# EasyEDA Pro project guitar-wireless-system.eprj

# Schematic Schematic1
Create Date: 2024-03-23; Page Name: P1; Project Name: guitar-wireless-system; Schematic Name: Schematic1; Update Date: 2025-01-12; Company: 嘉立创EDA; Page Size: A4; Version: V1.0
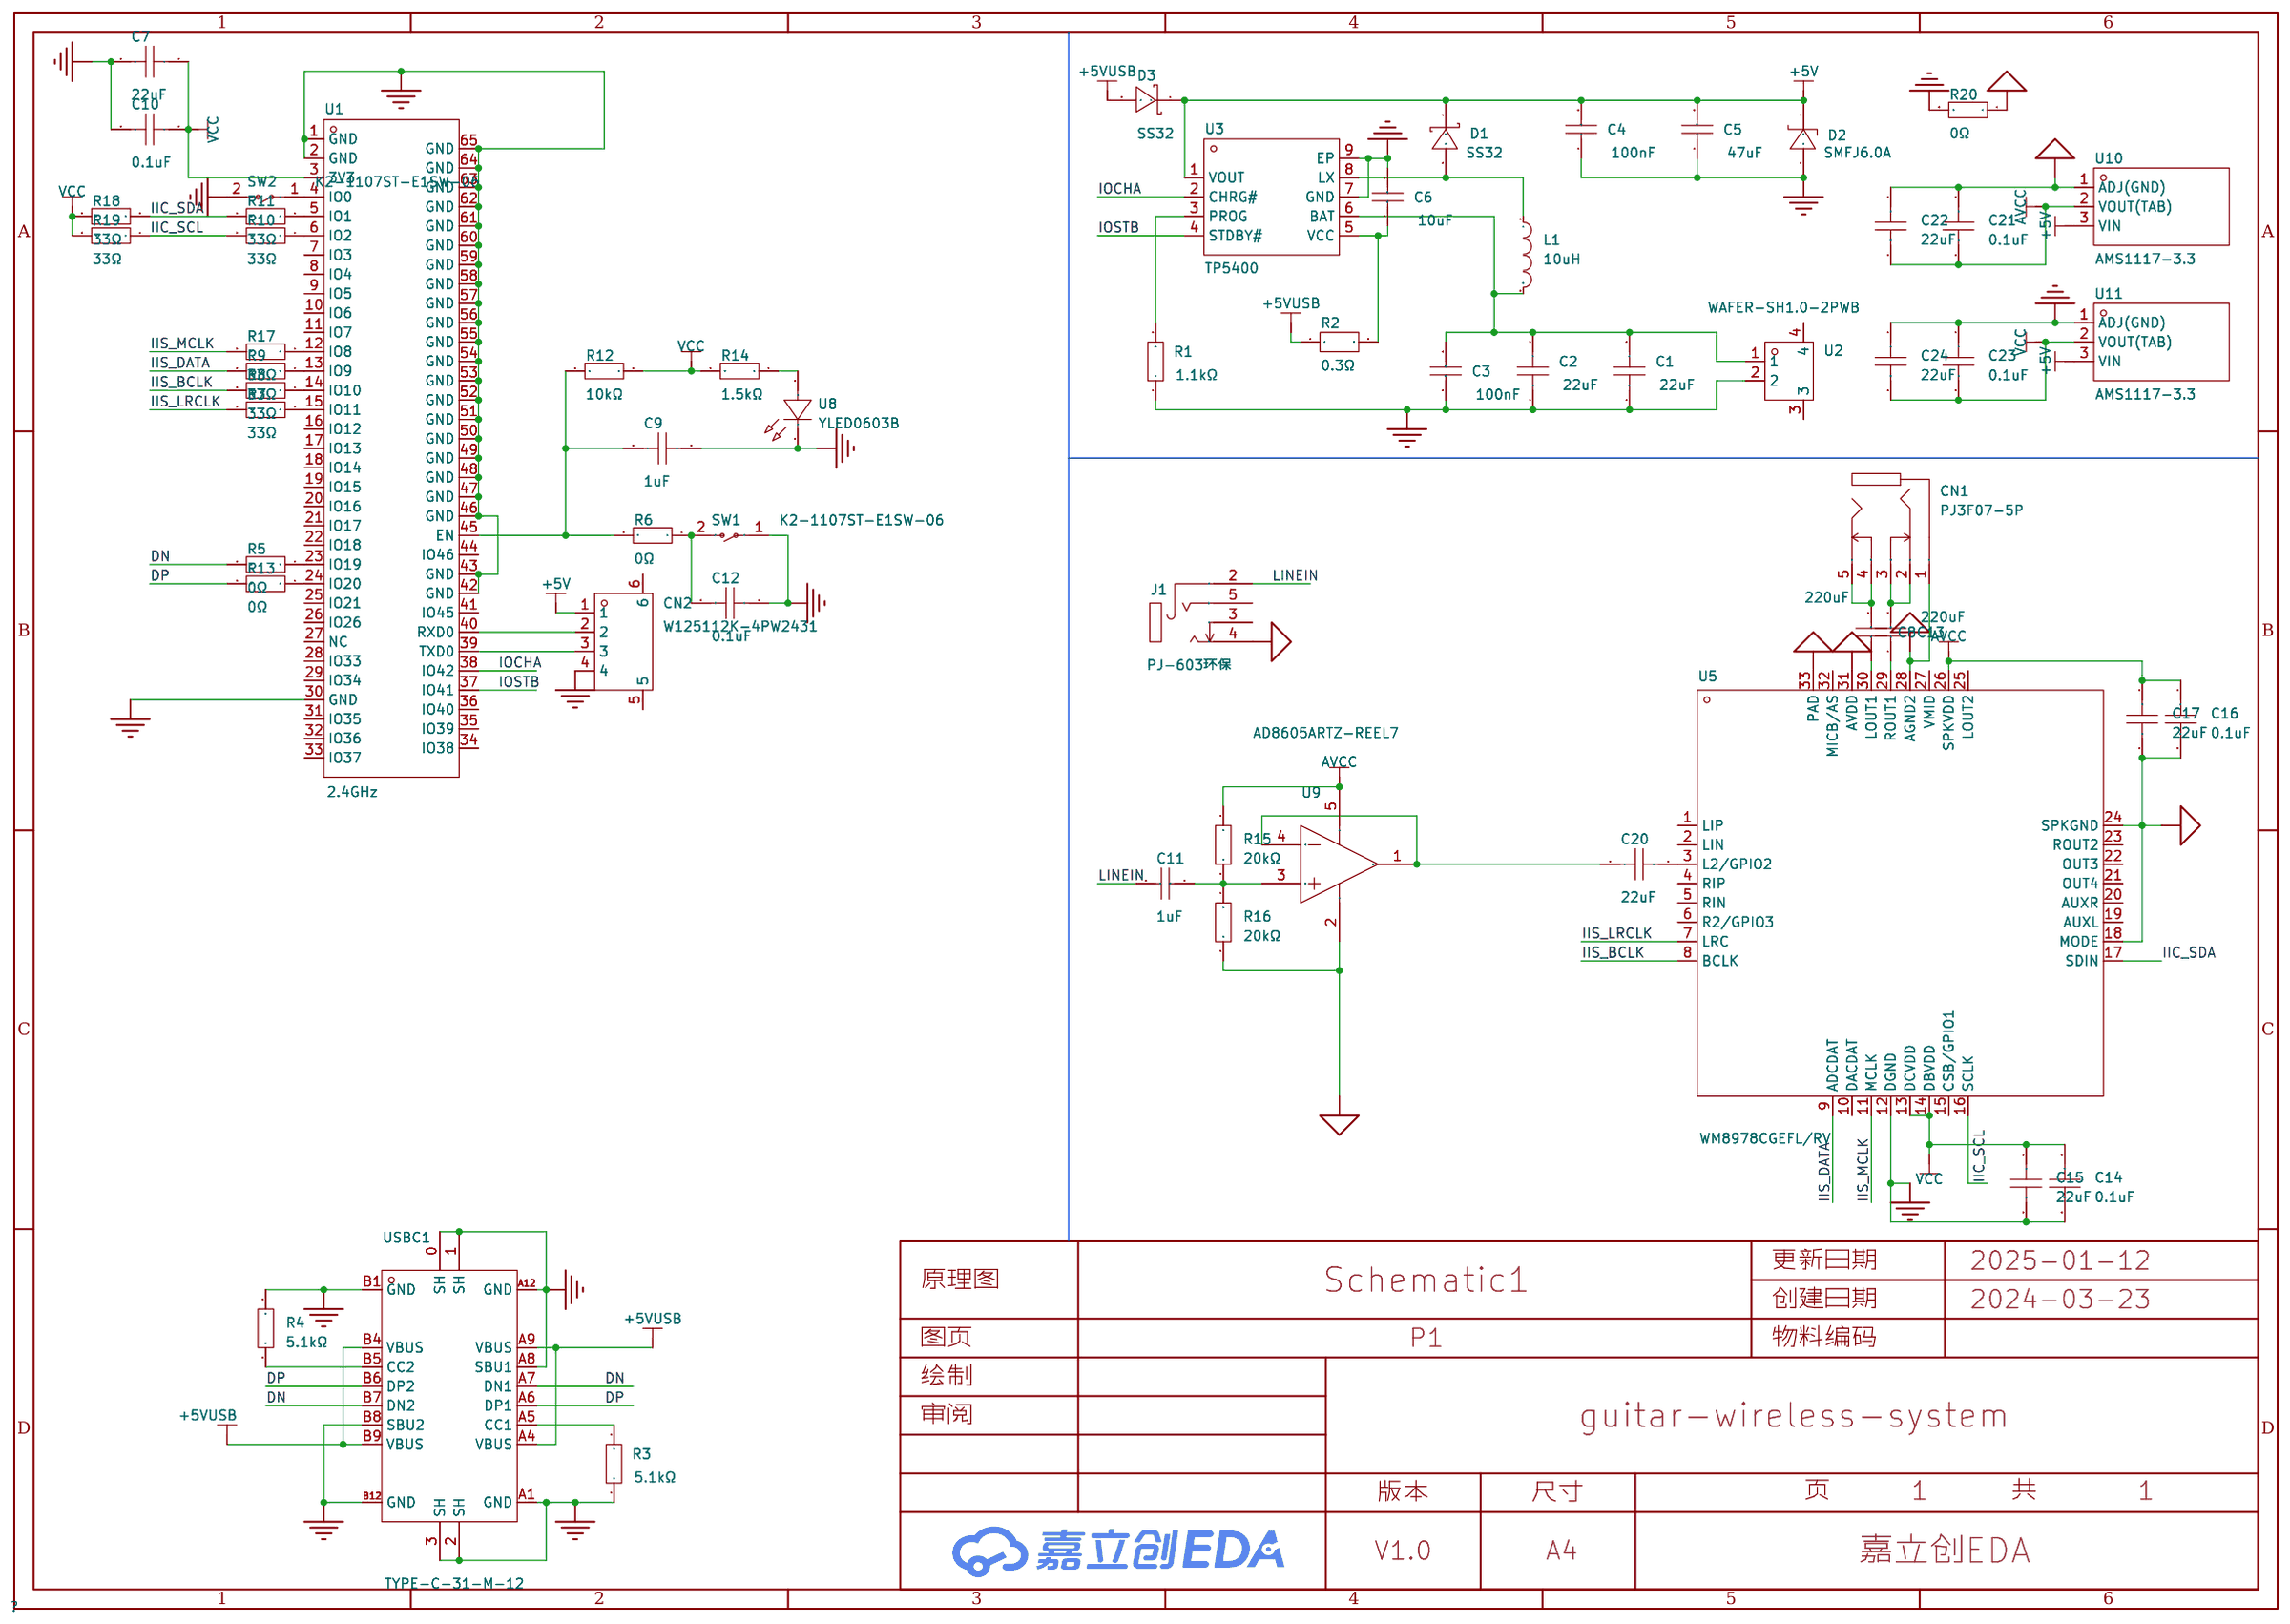
[diagram p0: schematic sheet]

## Parts
C1  22uF  [C0603]
C2  22uF  [C0603]
C3  100nF  [C0603]
C4  100nF  [C0603]
C5  47uF  [C0805]
C6  10uF  [C0805]
C7  22uF  [C0603]
C8  220uF  [C0805]
C9  1uF  [C0603]
C10  0.1uF  [C0603]
C11  1uF  [C0805]
C12  0.1uF  [C0603]
C13  220uF  [C0805]
C14  0.1uF  [C0603]
C15  22uF  [C0603]
C16  0.1uF  [C0603]
C17  22uF  [C0603]
C20  22uF  [C0603]
C21  0.1uF  [C0603]
C22  22uF  [C0603]
C23  0.1uF  [C0603]
C24  22uF  [C0603]
CN1  PJ3F07-5P  [AUDIO-TH_PJ3F07-5P]
CN2  W125112K-4PW2431  [CONN-SMD_4P-P1.25_W125112K-4PW2431]
D1  SS32  [SMA_L4.3-W2.6-LS5.2-RD]
D2  SMFJ6.0A  [SOD-123_L2.8-W1.8-LS3.7-RD]
D3  SS32  [SMA_L4.3-W2.6-LS5.2-RD]
J1  PJ-603环保  [AUDIO-TH_PJ-603]
L1  10uH  [IND-SMD_L7.3-W6.8]
R1  1.1kΩ  [R0603]
R2  0.3Ω  [R1812]
R3  5.1kΩ  [R0603]
R4  5.1kΩ  [R0603]
R5  0Ω  [R0603]
R6  0Ω  [R0603]
R7  33Ω  [R0603]
R8  33Ω  [R0603]
R9  33Ω  [R0603]
R10  33Ω  [R0603]
R11  33Ω  [R0603]
R12  10kΩ  [R0603]
R13  0Ω  [R0603]
R14  1.5kΩ  [R0603]
R15  20kΩ  [R0603]
R16  20kΩ  [R0603]
R17  33Ω  [R0603]
R18  33Ω  [R0603]
R19  33Ω  [R0603]
R20  0Ω  [R0603]
SW1  K2-1107ST-E1SW-06  [SW-SMD_L6.0-W3.6-LS8.0]
SW2  K2-1107ST-E1SW-06  [SW-SMD_L6.0-W3.6-LS8.0]
U1  2.4GHz  [WIFI-SMD_ESP32-MINI-1-N4]
U2  WAFER-SH1.0-2PWB  [CONN-SMD_2P-P1.00_XUNPU_WAFER-SH1.0-2PWB]
U3  TP5400  [ESOP-8_L4.9-W3.9-P1.27-LS6.0-BL-EP]
U5  WM8978CGEFL/RV  [WQFN-32_L5.0-W5.0-P0.50-TL-EP]
U8  YLED0603B  [LED0603-RD]
U9  AD8605ARTZ-REEL7  [SOT-23-5_L3.0-W1.7-P0.95-LS2.8-BR]
U10  AMS1117-3.3  [SOT-89_L4.5-W2.5-P1.50-LS4.2-BR]
U11  AMS1117-3.3  [SOT-89_L4.5-W2.5-P1.50-LS4.2-BR]
USBC1  TYPE-C-31-M-12  [USB-C_SMD-TYPE-C-31-M-12]

## Library data of the parts
C1 C2 C7 C9 C10 C12 C14-C17 C20-C24 = CL10A226MQ8NRNC: 容值:22uF;精度:±20%;额定电压:6.3V;材质(温度系数):X5R;; LCSC Part Name: 22uF ±20% 6.3V; Supplier Part: C59461; Manufacturer: SAMSUNG(三星); Supplier Footprint: 0603; JLCPCB Part Class: 基础库; Datasheet: https://atta.szlcsc.com/upload/public/pdf/source/20160218/1457707763339.pdf; Supplier: LCSC; Tolerance: ±20%; Voltage Rated: 6.3V; Temperature Coefficient: X5R
C3 C4 = 0603B104K500NT: 容值:100nF;精度:±10%;额定电压:50V;材质(温度系数):X7R;; LCSC Part Name: 100nF ±10% 50V; Supplier Part: C30926; Manufacturer: FH(风华); Supplier Footprint: 0603; JLCPCB Part Class: 扩展库; Datasheet: https://atta.szlcsc.com/upload/public/pdf/source/20200305/C486355_26A10D38EF8C2A5C37091D0039909270.pdf; Supplier: LCSC; Tolerance: ±10%; Voltage Rated: 50V; Temperature Coefficient: X7R
C5 C6 C8 C11 C13 = CL21A476MQYNNNE: 容值:47uF;精度:±20%;额定电压:6.3V;材质(温度系数):X5R;; LCSC Part Name: 47uF ±20% 6.3V; Supplier Part: C16780; Manufacturer: SAMSUNG(三星); Supplier Footprint: 0805; JLCPCB Part Class: 基础库; Datasheet: https://atta.szlcsc.com/upload/public/pdf/source/20160218/1457707763339.pdf; Supplier: LCSC; Tolerance: ±20%; Voltage Rated: 6.3V; Temperature Coefficient: X5R
CN1 = PJ3F07-5P: 连接器类型:3.5mm耳机座;额定电流:500mA;额定电压:30V;工作温度范围:-30℃~+70℃;; LCSC Part Name: 3.5mm耳机座; Supplier Part: C668604; Manufacturer: SHOU HAN(首韩); Supplier Footprint: 插件; JLCPCB Part Class: 扩展库; Datasheet: https://atta.szlcsc.com/upload/public/pdf/source/20200618/C668604_553D34851BA3C54B8828FD92D0D96818.pdf; Supplier: LCSC; Connector Type: 3.5mm耳机座; Current Rating (Max): 500mA; Voltage Rating (Max): 30V; Operating Temperature Range: -30℃~+70℃
CN2 = W125112K-4PW2431: 排数：单排 总PIN位数：4P 间距：1.25mm 针脚结构：1x4P 安装类型：卧贴  是否带锁扣：带扣 触头材质：黄铜 工作温度范围：-25℃~+85℃ 颜色：白色; LCSC Part Name: GH1.25 1x4P 卧贴; Supplier Part: C42382908; Manufacturer: HMTCONN(华明通); Supplier Footprint: SMD,P=1.25mm,卧贴; Datasheet: https://atta.szlcsc.com/upload/public/pdf/source/20241113/DA676F2A3096D0EC53C09A6060F09192.pdf; Supplier: LCSC
D1 D3 = SS32_C34897: 二极管配置:-;正向压降(Vf):550mV@3A;直流反向耐压(Vr):20V;平均整流电流(Io):3A;; LCSC Part Name: 电压:20V 电流:3A; Supplier Part: C34897; Manufacturer: MDD; Supplier Footprint: SMA(DO-214AC); JLCPCB Part Class: 扩展库; Datasheet: https://atta.szlcsc.com/upload/public/pdf/source/20230314/A80AE34493C69B89E2F4B1712F433538.pdf; Supplier: LCSC; Forward Voltage (Vf@If): 550mV@3A; Reverse Voltage (Vr): 20V; Average Rectified Current (Io): 3A
D2 = SMFJ6.0A_C44898: 反向截止电压(Vrwm):6V;最大钳位电压:10.3V;峰值脉冲电流(Ipp)@10/1000us:19.4A;击穿电压:6.67V;; Supplier Part: C44898; Manufacturer: RUILON(瑞隆源); Supplier Footprint: SOD-123; JLCPCB Part Class: 扩展库; Datasheet: https://atta.szlcsc.com/upload/public/pdf/source/20170601/1496285789057.pdf; Supplier: LCSC; Reverse Stand-Off Voltage (Vrwm): 6V; Maximum Clamping Voltage: 10.3V; Peak Pulse Current (Ipp)@10/1000us: 19.4A; Breakdown Voltage: 6.67V; Type: TVS
J1 = PJ-603环保: 连接器类型:6.35mm耳机座;额定电流:500mA;额定电压:30V;工作温度范围:-20℃~+70℃;; LCSC Part Name: 6.35mm耳机座 三件套; Supplier Part: C309272; Manufacturer: HOOYA(皓宇电子); Supplier Footprint: 插件; JLCPCB Part Class: Extended Part; Datasheet: https://atta.szlcsc.com/upload/public/pdf/source/20181226/C309272_C0E7296048E854FEB179FBAD0ADF7BD0.pdf; Supplier: LCSC; Connector Type: 6.35mm耳机座; Current Rating (Max): 500mA; Voltage Rating (Max): 30V; Operating Temperature Range: -20℃~+70℃
L1 = FXL0630-100-M: 电感值:10uH;精度:±20%;额定电流:4.5A;饱和电流(Isat):5.5A;类型:一体成型电感;; LCSC Part Name: 10uH ±20% 5.5A; Supplier Part: C167223; Manufacturer: cjiang(长江微电); Supplier Footprint: SMD,6.6x7mm; JLCPCB Part Class: 扩展库; Datasheet: https://atta.szlcsc.com/upload/public/pdf/source/20230516/3A080F5AF8C87BB81C3BA86E5F60E51A.pdf; Supplier: LCSC; Tolerance: ±20%; Rated Current: 4.5A; Saturation Current (Isat): 5.5A; DC Resistance (DCR): 68mΩ; Type: 一体成型电感
R1 R3-R20 = RC0603FR-071KL: 电阻类型:厚膜电阻;阻值:1kΩ;精度:±1%;功率:100mW;最大工作电压:75V;温度系数:±100ppm/℃;; LCSC Part Name: 厚膜电阻 1kΩ ±1% 100mW; Supplier Part: C22548; Manufacturer: YAGEO(国巨); Supplier Footprint: 0603; JLCPCB Part Class: 扩展库; Datasheet: https://atta.szlcsc.com/upload/public/pdf/source/20180316/70C0E2BDAE7FCC62C531A5A58D202EE1.pdf; Supplier: LCSC; Type: 厚膜电阻; Tolerance: ±1%; Power(Watts): 100mW; Overload Voltage (Max): 75V; Temperature Coefficient: ±100ppm/℃; Operating Temperature Range: -55℃~+155℃
R2 = FRC1812F1004TS: 电阻类型:厚膜电阻;阻值:1MΩ;精度:±1%;功率:750mW;最大工作电压:200V;温度系数:±100ppm/℃;; LCSC Part Name: 1MΩ ±1% 750mW 厚膜电阻; Supplier Part: C2933874; Manufacturer: FOJAN(富捷); Supplier Footprint: 1812; JLCPCB Part Class: 扩展库; Datasheet: https://atta.szlcsc.com/upload/public/pdf/source/20211221/925EC7D7225764EE0046F22065062C87.pdf; Supplier: LCSC; Type: 厚膜电阻; Tolerance: ±1%; Power(Watts): 750mW; Overload Voltage (Max): 200V; Temperature Coefficient: ±100ppm/℃; Operating Temperature Range: -55℃~+155℃
SW1 SW2 = K2-1107ST-E1SW-06: 作用力:90gf;安装方式:立贴;开关长度:6.1mm;开关宽度:3.6mm;开关高度:2.5mm;触点电流:50mA;额定电压(DC):12V;绝缘电阻:100MΩ;机械寿命:10万次;; LCSC Part Name: 362.5 进口弹片 有防水膜 灰胶头100G; Supplier Part: C707329; Manufacturer: 韩国韩荣; Supplier Footprint: SMD; JLCPCB Part Class: 扩展库; Datasheet: https://atta.szlcsc.com/upload/public/pdf/source/20210810/381712CEF248770C072B585C3485C888.pdf; Supplier: LCSC; Operating Force: 90gf; Mounting Style: 立贴; Switch Length: 6.1mm; Switch Width: 3.6mm; Switch Height: 2.5mm; Contact Current: 50mA; Voltage Rating (DC): 12V; Insulation Resistance: 100MΩ; Mechanical Life: 10万次; Operating Temperature: -25℃~+85℃
U1 = ESP32-S2-MINI-1-N4: 核心处理器:ESP32-S2FH4芯片;频率:2.4GHz;发射功率:19.5dBm;; Supplier Part: C2847294; Manufacturer: ESPRESSIF(乐鑫); Supplier Footprint: SMD-65P; JLCPCB Part Class: 扩展库; Datasheet: https://atta.szlcsc.com/upload/public/pdf/source/20210720/C2847294_01EA0498BFFB937767F2095C488AE4D4.pdf; Supplier: LCSC; Core Processor: ESP32-S2FH4芯片; Support Interface: I2C；GPIO；SPI；PWM；ADC；UART；USB；I2S; Output Power: 19.5dBm
U2 = WAFER-SH1.0-2PWB: 插针结构:1x2P;间距:1mm;安装方式:卧贴;总PIN数:2P;排数:1;每排PIN数:2;额定电流:1A;工作温度范围:-25℃~+85℃;; LCSC Part Name: 1x2P 间距:1mm 卧贴; Supplier Part: C3029341; Manufacturer: XUNPU(讯普); Supplier Footprint: SMD,P=1mm,卧贴; JLCPCB Part Class: 扩展库; Datasheet: https://atta.szlcsc.com/upload/public/pdf/source/20220527/1879B8210BD3B2006BCEAC1A40D397B6.pdf; Supplier: LCSC; Pins Structure: 1x2P; Pitch: 1mm; Mounting Style: 卧贴; Number of Pins: 2P; Number of Rows: 1; Number of PINs Per Row: 2; Current Rating (Max): 1A; Operating Temperature Range: -25℃~+85℃
U3 = TP5400: Supplier Part: C2891434; Manufacturer: TOPPOWER(南京拓微); Supplier Footprint: ESOP-8; JLCPCB Part Class: 扩展库; Datasheet: https://atta.szlcsc.com/upload/public/pdf/source/20210909/352D9D40D77A1DD73F7904E364EF004B.pdf; Supplier: LCSC
U5 = WM8978CGEFL/RV: LCSC Part Name: WM8978CGEFL/RV 停产; Supplier Part: C323850; Manufacturer: Cirrus Logic(凌云); Supplier Footprint: WQFN-32-EP(5x5); JLCPCB Part Class: 扩展库; Datasheet: https://atta.szlcsc.com/upload/public/pdf/source/20181105/C323850_5F65153DE4172B7DF9579D926852F69A.pdf; Supplier: LCSC
U8 = YLED0603B: 发光颜色:蓝色;正向电压(VF):2.6V~3.2V;功率:-;正向电流:30mA;主波长:460nm~475nm;发光角度:120°;工作温度:-40℃~+85℃;; Supplier Part: C19171394; Manufacturer: YONGYUTAI(永裕泰); Supplier Footprint: 0603; JLCPCB Part Class: 扩展库; Datasheet: https://atta.szlcsc.com/upload/public/pdf/source/20231027/6134FF4BA718E32A802654BBC76F69A6.pdf; Supplier: LCSC; Emitted Color: 蓝色; Forward Voltage (VF): 2.6V~3.2V; Forward Current: 30mA; Dominant Wavelength: 460nm~475nm; Viewing Angle: 120°; Operating Temperature: -40℃~+85℃
U9 = AD8605ARTZ-REEL7: 放大器数:单路;增益带宽积(GBP):10MHz;输入偏置电流(Ib):0.2pA;压摆率(SR):5V/us;轨到轨:-;; LCSC Part Name: 精密、低噪声、轨到轨输入输出、CMOS运算放大器（双路）; Supplier Part: C9641; Manufacturer: ADI(亚德诺); Supplier Footprint: SOT-23-5; JLCPCB Part Class: 扩展库; Datasheet: https://atta.szlcsc.com/upload/public/pdf/source/20121029/1457706543879.pdf; Supplier: LCSC; Number of Circuits: 单路; Gain Bandwidth Product(GBP): 10MHz; Current - Input Bias(Ib): 0.2pA; Slew Rate(SR): 5V/us; Output Current: 80mA; Operating Temperature: -40℃~+125℃
U10 U11 = AMS1117-3.3_C347256: 输出类型:固定;工作电压:18V;输出电压:3.3V;输出电流:1A;电源纹波抑制比(PSRR):60dB@(120Hz);输出极性:正极;; LCSC Part Name: 输出:3.3V 电流:1A 耐压:12V; Supplier Part: C347256; Manufacturer: UMW(友台半导体); Supplier Footprint: SOT-89; Datasheet: https://atta.szlcsc.com/upload/public/pdf/source/20241218/BAF0263FA2E44BCD8AF41AA4FA04EFAA.pdf; Supplier: LCSC; Output Type: 固定; Maximum Input Voltage: 18V; Output Voltage: 3.3V; Output Current: 1A; Power Supply Rejection Ratio (PSRR): 60dB@(120Hz); Dropout Voltage: 1.3V@(1A); Feature: 过流保护(OCP); Output Polarity: 正极; Number of Outputs: 1
USBC1 = TYPE-C-31-M-12: 连接器类型:Type-C;标准:-;公母:母;端口数量:1;触点数量:16P;安装方式:-;额定电流 - 电源:5A;触头材质:-;触头镀层:-;工作温度范围:-;焊接温度(最大值):-;; LCSC Part Name: Type-C 母; Supplier Part: C165948; Manufacturer: 韩国韩荣; Supplier Footprint: SMD; JLCPCB Part Class: 扩展库; Datasheet: https://atta.szlcsc.com/upload/public/pdf/source/20220525/466408E853115E789EDB0DDC29077C05.pdf; Supplier: LCSC; Connector Type: Type-C; Gender: 母; Number of Ports: 1; Number of Contacts: 16P; Current Rating - Power (Max): 5A

## Nets
+5V: C4.2 C5.2 CN2.1 D1.1(K) D2.1(K) D3.1(K) U3.1(VOUT) U10.3(VIN) U11.3(VIN)
+5VUSB: D3.2(A) R2.1 USBC1.A4(VBUS) USBC1.A9(VBUS) USBC1.B4(VBUS) USBC1.B9(VBUS)
AGND: C16.2 C17.2 C21.1 C22.1 CN1.1(A) J1.4 R16.2 R20.1 U5.18(MODE) U5.24(SPKGND) U5.28(AGND2) U5.31(AVDD) U5.33(PAD) U9.2(-V) U10.1(ADJ(GND))
AVCC: C16.1 C17.1 C21.2 C22.2 R15.1 U5.26(SPKVDD) U9.5(+V) U10.2(VOUT(TAB))
GND: C1.1 C2.1 C3.1 C4.1 C5.1 C6.2 C7.2 C9.1 C10.2 C12.1 C14.2 C15.2 C23.1 C24.1 CN2.4 D2.2(A) R1.1 R3.1 R4.1 R20.2 SW1.1 SW2.2 U1.1(GND) U1.2(GND) U1.30(GND) U1.42(GND) U1.43(GND) U1.46(GND) U1.47(GND) U1.48(GND) U1.49(GND) U1.50(GND) U1.51(GND) U1.52(GND) U1.53(GND) U1.54(GND) U1.55(GND) U1.56(GND) U1.57(GND) U1.58(GND) U1.59(GND) U1.60(GND) U1.61(GND) U1.62(GND) U1.63(GND) U1.64(GND) U1.65(GND) U2.2 U3.7(GND) U3.9(EP) U5.12(DGND) U8.1(K) U11.1(ADJ(GND)) USBC1.0(SH) USBC1.1(SH) USBC1.2(SH) USBC1.3(SH) USBC1.A1(GND) USBC1.A8(SBU1) USBC1.A12(GND) USBC1.B1(GND) USBC1.B8(SBU2) USBC1.B12(GND)
VCC: C7.1 C10.1 C14.1 C15.1 C23.2 C24.2 R12.1 R14.2 R18.2 R19.2 U1.3(3V3) U5.13(DCVDD) U5.14(DBVDD) U11.2(VOUT(TAB))
DN: R5.2 USBC1.A7(DN1) USBC1.B7(DN2)
DP: R13.2 USBC1.A6(DP1) USBC1.B6(DP2)
IIC_SCL: R10.2 R19.1 U5.16(SCLK)
IIC_SDA: R11.2 R18.1 U5.17(SDIN)
IIS_BCLK: R8.2 U5.8(BCLK)
IIS_DATA: R9.2 U5.9(ADCDAT)
IIS_LRCLK: R7.2 U5.7(LRC)
IIS_MCLK: R17.2 U5.11(MCLK)
IOCHA: U1.38(IO42) U3.2(CHRG#)
IOSTB: U1.37(IO41) U3.4(STDBY#)
LINEIN: C11.2 J1.2
$1N1673: R1.2 U3.3(PROG)
$1N3550: C6.1 R2.2 U3.5(VCC)
$1N3997: D1.2(A) L1.1 U3.8(LX)
$1N3998: C1.2 C2.2 C3.2 L1.2 U2.1 U3.6(BAT)
$1N4862: R3.2 USBC1.A5(CC1)
$1N6147: R4.2 USBC1.B5(CC2)
$1N12969: C12.2 R6.1 SW1.2
$1N13877: C9.2 R6.2 R12.2 U1.45(EN)
$1N19075: C8.2 CN1.4(D) CN1.5(E)
$1N19138: C13.2 CN1.2(B) CN1.3(C)
$1N22244: C8.1 U5.30(LOUT1)
$1N22432: C13.1 U5.29(ROUT1)
$1N23425: R13.1 U1.24(IO20)
$1N23503: R5.1 U1.23(IO19)
$1N35924: R14.1 U8.2(A)
$1N36589: CN2.2 U1.40(RXD0)
$1N36667: CN2.3 U1.39(TXD0)
$1N39673: C20.2 U5.3(L2/GPIO2)
$1N42115: C20.1 U9.1(OUT) U9.4(-IN)
$1N45611: C11.1 R15.2 R16.1 U9.3(+IN)
$1N56057: R10.1 U1.6(IO2)
$1N56058: R11.1 U1.5(IO1)
$1N56623: R17.1 U1.12(IO8)
$1N56625: R7.1 U1.15(IO11)
$1N56627: R8.1 U1.14(IO10)
$1N56629: R9.1 U1.13(IO9)
$1N61302: SW2.1 U1.4(IO0)

Not connected (* = marked no-connect by the designer): CN2 5 6; J1 3 5; U1 7(IO3) 8(IO4) 9(IO5) 10(IO6) 11(IO7) 16(IO12) 17(IO13) 18(IO14) 19(IO15) 20(IO16) 21(IO17) 22(IO18) 25(IO21) 26(IO26) 27(NC) 28(IO33) 29(IO34) 31(IO35) 32(IO36) 33(IO37) 34(IO38) 35(IO39) 36(IO40) 41(IO45) 44(IO46); U2 3 4; U5 1(LIP) 2(LIN) 4(RIP) 5(RIN) 6(R2/GPIO3) 10(DACDAT) 15(CSB/GPIO1) 19(AUXL) 20(AUXR) 21(OUT4) 22(OUT3) 23(ROUT2) 25(LOUT2) 27(VMID) 32(MICB/AS)

# Board PCB1
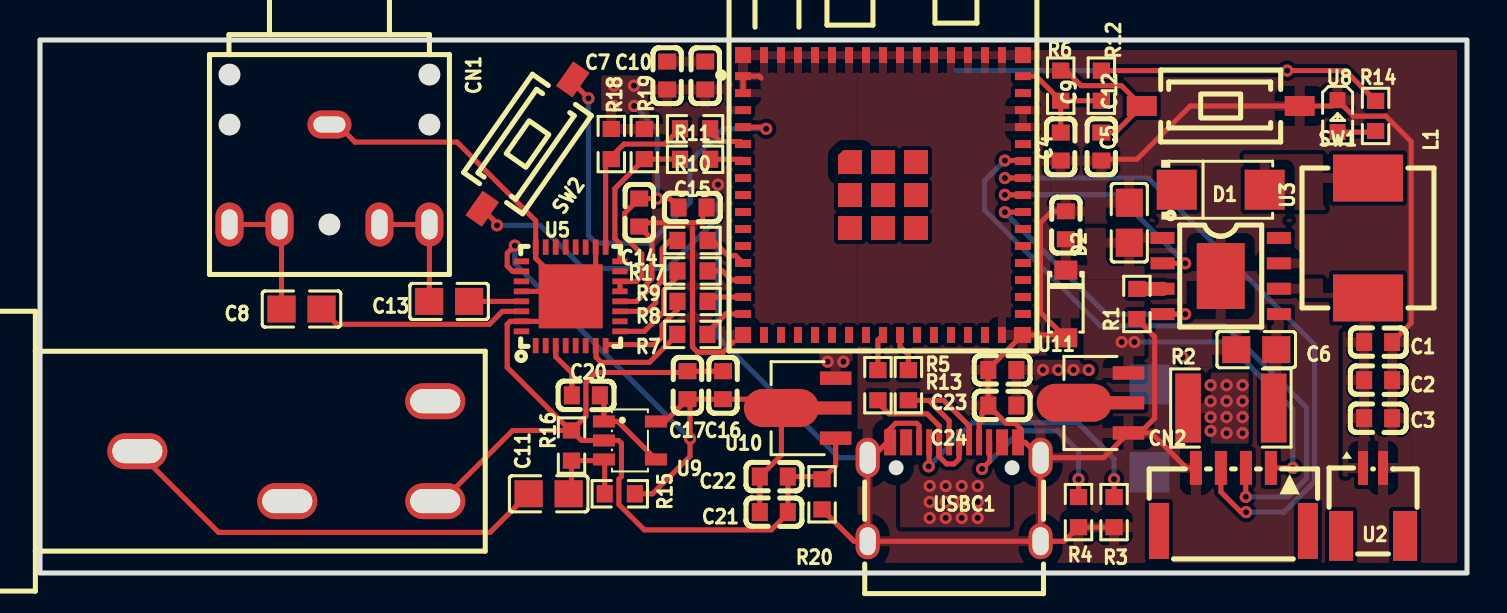
[diagram p1: board, top side]
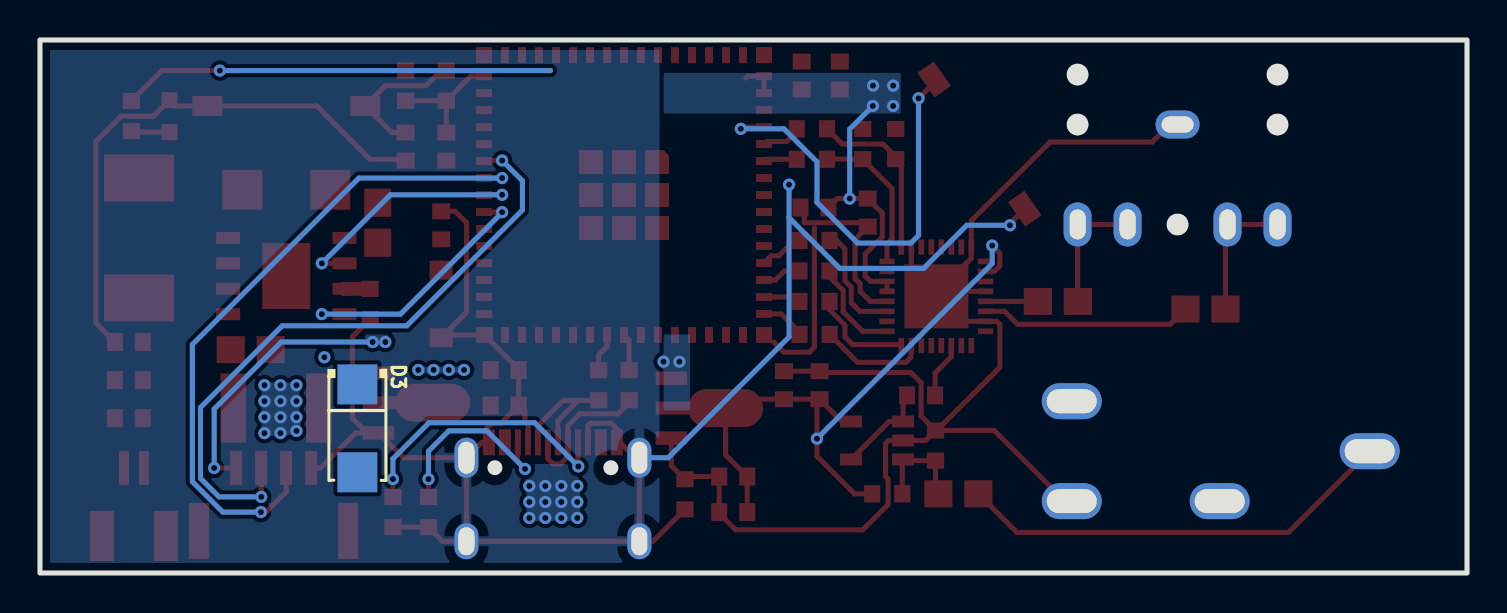
[diagram p2: board, bottom side, seen from below]

Outline 71.37 x 26.67 mm; copper layers: Top Layer, Bottom Layer. Coordinates in mm from the lower left corner of the outline.
Outline path: rectangle 0,26.67 71.37,0
Stack: Top Layer 0.035mm / Dielectric1 1.51mm FR4 er 4.5 / Bottom Layer 0.035mm

## Design rules (mm)
spacing safeClearance (default): track to track 0.152, other pairs 0.152 to 0.3
track width trackWidth (default): min 0.127, default 0.254, max 2.54
differential pair differentialPair (default): width min 0.127, default 0.254, max 2.54; gap min 0.152, default 0.152
via viaSize (default): diameter min 0.5, default 0.61, max 10; hole min 0.3, default 0.305, max 6
pour e115 uses copperRegion1

## Placement (name value [footprint] x y rotation side)
C1  22uF  [C0603]  66.93 11.56 180 top
C2  22uF  [C0603]  66.93 9.65 180 top
C3  100nF  [C0603]  66.93 7.75 180 top
C4  100nF  [C0603]  51.31 17.4 270 top
C5  47uF  [C0805]  54.48 17.53 270 top
C6  10uF  [C0805]  60.83 11.18 180 top
C7  22uF  [C0603]  31.37 24.89 90 top
C8  220uF  [C0805]  13.08 13.21 180 top
C9  1uF  [C0603]  51.05 21.34 90 top
C10  0.1uF  [C0603]  33.27 24.89 90 top
C11  1uF  [C0805]  25.44 3.97 180 top
C12  0.1uF  [C0603]  53.09 21.34 90 top
C13  220uF  [C0805]  20.46 13.59 180 top
C14  0.1uF  [C0603]  29.97 18.03 270 top
C15  22uF  [C0603]  32.64 18.29 0 top
C16  0.1uF  [C0603]  34.16 9.4 90 top
C17  22uF  [C0603]  32.38 9.4 90 top
C20  22uF  [C0603]  27.31 8.89 180 top
C21  0.1uF  [C0603]  36.7 3.05 180 top
C22  22uF  [C0603]  36.7 4.83 180 top
C23  0.1uF  [C0603]  48.13 10.16 0 top
C24  22uF  [C0603]  48.13 8.38 0 top
CN1  PJ3F07-5P  [AUDIO-TH_PJ3F07-5P]  14.48 19.94 0 top
CN2  W125112K-4PW2431  [CONN-SMD_4P-P1.25_W125112K-4PW2431]  59.69 3.68 0 top
D1  SS32  [SMA_L4.3-W2.6-LS5.2-RD]  59.06 19.18 0 top
D2  SMFJ6.0A  [SOD-123_L2.8-W1.8-LS3.7-RD]  51.31 13.46 270 top
D3  SS32  [SMA_L4.3-W2.6-LS5.2-RD]  55.5 7.24 270 bottom
J1  PJ-603环保  [AUDIO-TH_PJ-603]  12.32 6.1 0 top
L1  10uH  [IND-SMD_L7.3-W6.8]  66.42 16.76 270 top
R1  1.1kΩ  [R0603]  54.86 13.46 90 top
R2  0.3Ω  [R1812]  59.56 8.25 0 top
R3  5.1kΩ  [R0603]  53.72 3.05 90 top
R4  5.1kΩ  [R0603]  51.94 3.05 90 top
R5  0Ω  [R0603]  41.91 9.4 270 top
R6  0Ω  [R0603]  51.05 24.38 270 top
R7  33Ω  [R0603]  32.63 11.94 180 top
R8  33Ω  [R0603]  32.64 13.59 180 top
R9  33Ω  [R0603]  32.64 15.11 180 top
R10  33Ω  [R0603]  32.77 20.7 180 top
R11  33Ω  [R0603]  32.77 22.22 180 top
R12  10kΩ  [R0603]  53.09 24.38 270 top
R13  0Ω  [R0603]  43.43 9.4 270 top
R14  1.5kΩ  [R0603]  66.8 22.87 90 top
R15  20kΩ  [R0603]  29 3.97 180 top
R16  20kΩ  [R0603]  26.59 6.38 90 top
R17  33Ω  [R0603]  32.64 16.64 180 top
R18  33Ω  [R0603]  28.57 21.46 90 top
R19  33Ω  [R0603]  30.23 21.46 90 top
R20  0Ω  [R0603]  39.12 3.94 270 top
SW1  K2-1107ST-E1SW-06  [SW-SMD_L6.0-W3.6-LS8.0]  59.06 23.37 180 top
SW2  K2-1107ST-E1SW-06  [SW-SMD_L6.0-W3.6-LS8.0]  24.38 21.46 235 top
U1  2.4GHz  [WIFI-SMD_ESP32-MINI-1-N4]  42.16 18.91 0 top
U2  WAFER-SH1.0-2PWB  [CONN-SMD_2P-P1.00_XUNPU_WAFER-SH1.0-2PWB]  66.67 3.56 0 top
U3  TP5400  [ESOP-8_L4.9-W3.9-P1.27-LS6.0-BL-EP]  59.06 14.86 270 top
U5  WM8978CGEFL/RV  [WQFN-32_L5.0-W5.0-P0.50-TL-EP]  26.54 13.84 90 top
U8  YLED0603B  [LED0603-RD]  64.9 22.86 270 top
U9  AD8605ARTZ-REEL7  [SOT-23-5_L3.0-W1.7-P0.95-LS2.8-BR]  29.51 6.63 180 top
U10  AMS1117-3.3  [SOT-89_L4.5-W2.5-P1.50-LS4.2-BR]  38.44 8.25 0 top
U11  AMS1117-3.3  [SOT-89_L4.5-W2.5-P1.50-LS4.2-BR]  53.09 8.51 0 top
USBC1  TYPE-C-31-M-12  [USB-C_SMD-TYPE-C-31-M-12]  45.72 4.06 0 top

## Footprints (pads in the part's own frame, mm; a bottom-side part is the same pattern mirrored in y, then rotated)
AUDIO-TH_PJ3F07-5P
  oval 2.2x1.4 hole 1.6x0.8: 1(0,2.5)
  oval 1.4x2.2 hole 0.8x1.5: 2(5,-2.5) 3(2.5,-2.5) 4(-2.5,-2.5) 5(-5,-2.5)
AUDIO-TH_PJ-603
  oval 3x1.8 hole 2.501x1.2: 2(-7.45,0) 3(0.05,-2.5) 4(7.45,-2.5) 5(7.45,2.5)
C0603
  rect 0.8x0.9 smd: 1(-0.7,0) 2(0.7,0)
C0805
  rect 1.41x1.35 smd: 1(-1,0) 2(1,0)
CONN-SMD_2P-P1.00_XUNPU_WAFER-SH1.0-2PWB
  rect 0.5x1.7 smd: 1(-0.5,1.7) 2(0.5,1.7)
  rect 1.2x2.5 smd: 3(1.6,-1.7) 4(-1.6,-1.7)
CONN-SMD_4P-P1.25_W125112K-4PW2431
  rect 0.6x1.7 smd: 1(1.875,1.575) 2(0.625,1.575) 3(-0.625,1.575) 4(-1.875,1.575)
  rect 1x2.8 smd: 5(-3.725,-1.575) 6(3.725,-1.575)
ESOP-8_L4.9-W3.9-P1.27-LS6.0-BL-EP
  rect 0.6x1.2 smd: 1(-1.905,-2.909) 2(-0.635,-2.909) 3(0.635,-2.909) 4(1.905,-2.909) 5(1.905,2.909) 6(0.635,2.909) 7(-0.635,2.909) 8(-1.905,2.909)
  rect 3.3x2.4 smd: 9(0,0)
IND-SMD_L7.3-W6.8
  rect 2.35x3.5 smd: 1(-3,0) 2(3,0)
LED0603-RD
  rect 0.8x0.8 smd: 1(-0.799,0) 2(0.799,0)
R0603
  rect 0.806x0.864 smd: 1(-0.753,0) 2(0.753,0)
R1812
  rect 1.282x3.456 smd: 1(-2.141,0) 2(2.141,0)
SMA_L4.3-W2.6-LS5.2-RD
  rect 2x2 smd: 1(-2.2,0) 2(2.2,0)
SOD-123_L2.8-W1.8-LS3.7-RD
  rect 0.95x1.15 smd: 1(-1.692,0) 2(1.692,0)
SOT-23-5_L3.0-W1.7-P0.95-LS2.8-BR
  rect 1.1x0.6 smd: 1(1.3,-0.95) 2(1.3,0) 3(1.3,0.95) 4(-1.3,0.95) 5(-1.3,-0.95)
SOT-89_L4.5-W2.5-P1.50-LS4.2-BR
  rect 1.575x0.672 smd: 1(1.356,-1.5) 3(1.356,1.5)
  custom 5.377x1.9 smd: 2(-1.356,0.009)
SW-SMD_L6.0-W3.6-LS8.0
  rect 1.5x1 smd: 1(-3.95,0) 2(3.95,0)
USB-C_SMD-TYPE-C-31-M-12
  oval 1.2x2 hole 0.8x1.6: 0(-4.325,1.706) 1(4.325,1.706)
  oval 1.2x1.8 hole 0.8x1.4: 2(4.325,-2.474) 3(-4.325,-2.474)
  rect 0.3x1.3 smd: A1(-3.35,2.474) A4(-2.55,2.474) A5(-1.25,2.474) A6(-0.25,2.474) A7(0.25,2.474) A8(1.25,2.474) A9(2.55,2.474) A12(3.35,2.474) B1(3.05,2.474) B4(2.25,2.474) B5(1.75,2.474) B6(0.75,2.474) B7(-0.75,2.474) B8(-1.75,2.474) B9(-2.25,2.474) B12(-3.05,2.474)
WIFI-SMD_ESP32-MINI-1-N4
  rect 0.8x0.4 smd: 1(-7,5.95) 2(-7,5.1) 3(-7,4.25) 4(-7,3.4) 5(-7,2.55) 6(-7,1.7) 7(-7,0.85) 8(-7,0.001) 9(-7,-0.85) 10(-7,-1.7) 11(-7,-2.55) 12(-7,-3.4) 13(-7,-4.25) 14(-7,-5.1) 15(-7,-5.949) 31(7,-5.95) 32(7,-5.1) 33(7,-4.25) 34(7,-3.4) 35(7,-2.55) 36(7,-1.7) 37(7,-0.85) 38(7,-0.001) 39(7,0.85) 40(7,1.7) 41(7,2.55) 42(7,3.4) 43(7,4.25) 44(7,5.1) 45(7,5.949)
  rect 0.4x0.8 smd: 16(-5.95,-7) 17(-5.1,-7) 18(-4.25,-7) 19(-3.4,-7) 20(-2.55,-7) 21(-1.7,-7) 22(-0.85,-7) 23(-0.001,-7) 24(0.85,-7) 25(1.7,-7) 26(2.55,-7) 27(3.4,-7) 28(4.25,-7) 29(5.1,-7) 30(5.949,-7) 46(5.95,7) 47(5.1,7) 48(4.25,7) 49(3.4,7) 50(2.55,7) 51(1.7,7) 52(0.85,7) 53(0,7) 54(-0.85,7) 55(-1.7,7) 56(-2.55,7) 57(-3.4,7) 58(-4.25,7) 59(-5.1,7) 60(-5.95,7)
  custom 1.2x1.2 smd: 61(-1.65,1.65)
  rect 1.2x1.2 smd: 61(-1.65,0) 61(-1.65,-1.65) 61(0,1.65) 61(0,0) 61(0,-1.65) 61(1.649,-1.65) 61(1.65,1.65) 61(1.65,0)
  rect 0.8x0.8 smd: 62(-7,7) 63(-7,-7) 65(7,7)
  rect 0.85x0.8 smd: 64(6.975,-7)
WQFN-32_L5.0-W5.0-P0.50-TL-EP
  rect 0.762x0.287 smd: 1(-2.464,1.75) 2(-2.464,1.25) 3(-2.464,0.75) 4(-2.464,0.25) 5(-2.464,-0.25) 6(-2.464,-0.75) 7(-2.464,-1.25) 8(-2.464,-1.75) 17(2.464,-1.75) 18(2.464,-1.25) 19(2.464,-0.75) 20(2.464,-0.25) 21(2.464,0.25) 22(2.464,0.75) 23(2.464,1.25) 24(2.464,1.75)
  rect 0.287x0.762 smd: 9(-1.75,-2.464) 10(-1.25,-2.464) 11(-0.75,-2.464) 12(-0.25,-2.464) 13(0.25,-2.464) 14(0.75,-2.464) 15(1.25,-2.464) 16(1.75,-2.464) 25(1.75,2.464) 26(1.25,2.464) 27(0.75,2.464) 28(0.25,2.464) 29(-0.25,2.464) 30(-0.75,2.464) 31(-1.25,2.464) 32(-1.75,2.464)
  rect 3.2x3.2 smd: 33(0,0)

## Nets
As in the schematic.

Pads without a net: CN2 5 6; J1 3 5; U1 7 8 9 10 11 16 17 18 19 20 21 22 25 26 27 28 29 31 32 33 34 35 36 41 44; U2 3 4; U5 1 2 4 5 6 10 15 19 20 21 22 23 25 27 32

## Via types
v1: diameter 0.61, hole 0.305, Top Layer to Bottom Layer, 58 vias

## Routing (per net, layer and track width the routed paths; a pad name or vN(x,y) marks a point on that pad's centre or on a via; arc(x,y) is an arc through that point)
+5V: length 13.5
  Top Layer w0.254: CN2.1 v1(62.66,5.26) 62.74,5.33
  Bottom Layer w0.254: v1(54.74,11.56) 59.31,11.56 62.66,8.2 v1(62.66,5.26)
  vias: v1(39.39,10.57) v1(40.18,10.57) v1(54.1,11.56)
+5VUSB:
  vias: v1(44.5,4.36) v1(44.5,3.56) v1(44.5,2.76) v1(45.3,4.36) v1(45.3,3.56) v1(45.3,2.76) v1(46.1,4.36) v1(46.1,3.56) v1(46.1,2.76) v1(46.9,4.36) v1(46.9,3.56) v1(46.9,2.76) v1(58.55,9.4) v1(58.55,8.6) v1(58.55,7.8) v1(58.55,7.11) v1(59.35,9.4) v1(59.35,8.6) v1(59.35,7.8) v1(59.35,7) v1(60.15,9.4) v1(60.15,8.6) v1(60.15,7.8) v1(60.15,7)
AGND: length 71.9
  Top Layer w0.254: U10.1 39.8,5.37 R20.1 38.98,4.83 C22.1 C21.1 37.4,2.99 36.58,2.16 30.23,2.16 28.96,3.43 28.96,4.7 29.08,4.83 29.08,6.48 28.93,6.63 U9.2 27.08,6.63 R16.2 ; CN1.1 14.88,22.44 15.76,21.56 20.86,21.56 24.79,17.62 U5.24 24.79,15.75 26.54,14 U5.33 ; J1.4 20.11,3.6 23.64,7.13 26.52,7.13 ; U5.33 26.29,14.09 U5.28 ; U5.33 25.29,12.59 U5.31 23.52,12.59 23.37,12.44 23.37,10.29 26.52,7.13 ; U5.33 27.79,15.09 U5.18 ; R16.2 27.31,7.85 27.31,9.52 27.81,10.03 32.32,10.03 C17.2 C16.2 ; R16.2 26.52,7.13
AVCC: length 34.3
  Top Layer w0.254: 30.81,7.58 31.27,7.58 C17.1 ; C17.1 32.51,8.57 v1(32.51,6.72) 32.51,5.84 30.63,3.97 R15.1 ; C17.1 C16.1 36.64,8.7 U10.2 37.08,5.91 C22.2 C21.2 ; U5.26 23.64,15.09 23.37,15.37 23.37,16 v1(23.75,16.38)
  Bottom Layer w0.254: v1(23.75,16.38) 23.75,15.48 v1(32.51,6.72)
GND: length 142.7
  Top Layer w0.254: 32.64,17.27 32.64,11.3 32.89,11.05 34.16,11.05 34.67,11.56 ; R1.1 55.75,11.82 55.75,7.75 55.01,7.01 ; SW2.2 22.86,17.49 v1(22.86,17.4) ; C1.1 68.58,12.51 68.58,21.59 67.31,22.86 65.7,22.86 U8.1 64.61,23.37 SW1.1 57.53,23.37 54.86,20.7 53.15,20.7 C12.1 ; USBC1.1 53.2,5.77 U11.1 55.01,7.01 ; USBC1.1 USBC1.2 ; USBC1.1 49.28,6.54 USBC1.A12 49.07,7.19 48.77,7.49 48.32,7.49 C24.1 ; C15.2 33.15,18.1 33.15,17.53 30.16,17.53 C14.2 30.61,16.7 30.61,14.73 30.35,14.48 30.35,14.1 29.84,13.59 29.39,13.59 29.39,13.59 ; USBC1.3 USBC1.0 41.6,5.77 USBC1.A1 42.37,7.06 42.8,7.49 43.84,7.49 43.97,7.37 USBC1.B8 ; USBC1.3 40.71,1.59 R20.2 ; USBC1.3 USBC1.2 ; 55.01,7.01 55.59,7.01 57.34,5.26 CN2.4 ; 36.07,24.77 35.97,24.86 U1.1 U1.2 ; C24.1 C23.1 47.43,10.21 U1.64 51.17,11.91 ; C24.1 47.12,8.07 47.12,7.62 46.97,7.47 USBC1.A8 ; 51.17,11.91 50.04,13.04 50.04,17.53 50.61,18.1 C4.1 ; 51.17,11.91 D2.2 ; R3.1 R4.1 51.24,1.59 USBC1.2
  Bottom Layer w0.254: 33.91,17.78 31.37,15.24 27.18,15.24 25.02,17.4 v1(22.86,17.4) ; 33.91,17.78 v1(33.91,19.43) ; 33.91,17.78 33.91,11.81 39.95,5.77 USBC1.0
VCC: length 44
  Top Layer w0.254: C15.1 31.49,18.73 v1(30.88,18.73) C14.1 29.24,18 29.24,16.82 30.1,15.96 30.1,14.86 29.83,14.59 29.39,14.59 ; R14.2 65.29,25.14 v1(62.38,25.14) R12.1 ; U5.14 U5.13
  Bottom Layer w0.254: v1(62.38,25.14) 45.86,25.14 45.85,25.15 ; v1(30.88,18.73) 30.88,22.21 v1(29.72,23.37)
  vias: v1(28.7,24.38) v1(28.7,23.37) v1(29.71,24.38) v1(50.16,10.16) v1(50.93,10.16) v1(51.69,10.16) v1(52.45,10.16)
(no net):
  vias: v1(57.15,10.8)
DN: length 7.2
  Top Layer w0.254: USBC1.A7 45.97,5.71 45.72,5.46 45.34,5.46 44.96,5.84 44.96,6.53 USBC1.B7 44.97,7.37 44.37,7.96 42.47,7.96 41.91,8.52
DP: length 6.9
  Top Layer w0.254: USBC1.A6 45.47,7.62 44.45,8.64 ; 44.45,8.64 43.44,8.64 R13.2 ; 44.45,8.64 45.2,8.64 46.47,7.37 USBC1.B6
IIC_SCL: length 7.6
  Top Layer w0.254: R10.2 32,20.71 R19.1 28.75,19.24 28.75,16.73 29.01,16.48 U5.16
IIC_SDA: length 8.7
  Top Layer w0.254: R11.2 31.25,21.46 29.21,21.46 28.57,20.83 R18.1 28.29,20.43 U5.17
IIS_BCLK: length 5.1
  Top Layer w0.254: R8.2 31.89,13.18 31.12,12.41 31.12,11.81 30.73,11.43 28.34,11.43 U5.8
IIS_DATA: length 4.5
  Top Layer w0.254: R9.2 31.89,14.82 31.2,14.14 31.2,13.07 30.23,12.09 29.39,12.09
IIS_LRCLK: length 5.3
  Top Layer w0.254: R7.2 30.48,10.54 28.07,10.54 27.81,10.8 27.81,11.36 U5.7
IIS_MCLK: length 5.4
  Top Layer w0.254: R17.2 31.53,16.64 31.12,16.23 31.12,14.62 30.8,14.3 30.8,13.52 30.37,13.09 29.39,13.09
IOCHA: length 12.5
  Top Layer w0.254: v1(57.28,15.49) U3.2 ; U1.38 49.15,18.92 v1(48.26,18.92)
  Bottom Layer w0.254: v1(57.28,15.49) 53.85,18.92 v1(48.26,18.92)
IOSTB: length 13.2
  Top Layer w0.254: v1(48.26,18.05) 49.16,18.05 U1.37 ; v1(57.28,12.95) U3.4
  Bottom Layer w0.254: v1(48.26,18.05) 48.26,18.03 53.34,12.95 v1(57.28,12.95)
LINEIN: length 22.1
  Top Layer w0.254: C11.2 22.51,2.03 8.93,2.03 J1.2
$1N1673: length 1.3
  Top Layer w0.7: R1.2 56.14,14.22 56.15,14.22
$1N4862: length 14
  Top Layer w0.254: v1(44.45,5.33) 44.47,5.35 USBC1.A5 ; v1(53.72,4.7) R3.2
  Bottom Layer w0.254: v1(44.45,5.33) 46.63,7.52 51.92,7.52 53.72,5.72 v1(53.72,4.7)
$1N6147: length 9.8
  Top Layer w0.254: v1(51.94,4.7) R4.2 ; USBC1.B5 47.5,6.51 47.5,5.59 v1(47.12,5.21)
  Bottom Layer w0.254: v1(51.94,4.7) 51.94,6.1 50.93,7.11 49.02,7.11 v1(47.12,5.21)
$1N12969: length 7.4
  Top Layer w0.254: C12.2 53.77,22.04 SW1.2 54.09,24.38 52.07,24.38 51.32,25.14 R6.1
$1N13877: length 6
  Top Layer w0.254: U1.45 49.82,24.86 R6.2 ; R6.2 C9.2 ; R6.2 R12.2
$1N19075: length 6.8
  Top Layer w0.254: C8.2 12.08,17.34 CN1.4 9.48,17.44
$1N19138: length 6.4
  Top Layer w0.254: CN1.3 CN1.2 19.48,13.6 C13.2
$1N22244: length 10.6
  Top Layer w0.254: C8.1 14.84,12.45 22.48,12.45 23.13,13.09 U5.30
$1N22432: length 2.6
  Top Layer w0.254: U5.29 24.07,13.59 C13.1
$1N23425: length 2.1
  Top Layer w0.254: U1.24 43.01,11.33 43.43,10.91 43.43,10.02
$1N23503: length 2
  Top Layer w0.254: 41.91,10.02 41.91,11.66 U1.23
$1N35924: length 1.9
  Top Layer w0.254: U8.2 66.75,22.06 R14.1
$1N36589: length 32.4
  Top Layer w0.254: v1(48.26,20.64) 49.13,20.64 U1.40 ; CN2.2 60.31,5.25 v1(60.31,3.81)
  Bottom Layer w0.254: v1(48.26,20.64) 47.24,19.62 47.24,18.16 53.04,12.37 59.26,12.37 63.35,8.28 63.35,4.74 62.42,3.81 v1(60.31,3.81)
$1N36667: length 33.6
  Top Layer w0.254: CN2.3 59.06,4.05 60.07,3.05 v1(60.32,3.05) ; v1(48.26,19.76) U1.39
  Bottom Layer w0.254: v1(60.32,3.05) 62.23,3.05 63.75,4.57 63.75,11.43 55.42,19.76 v1(48.26,19.76)
$1N39673: length 2.8
  Top Layer w0.254: U5.3 25.79,10.82 26.6,10.01 C20.2
$1N42115: length 4.8
  Top Layer w0.254: C20.1 28.21,8.69 28.21,7.58 28.91,7.58 30.81,5.68
$1N45611: length 5.1
  Top Layer w0.254: C11.1 26.59,4.11 R16.1 28.15,5.62 U9.3 28.24,5.64 R15.2
$1N56057: length 1.7
  Top Layer w0.254: R10.1 35.07,20.7 U1.6
$1N56058: length 2
  Top Layer w0.254: R11.1 33.52,22.11 34.04,21.59 35.03,21.59 U1.5
$1N56623: length 2.2
  Top Layer w0.254: 35.16,15.51 34.8,15.88 34.42,15.88 33.66,16.64 R17.1
$1N56625: length 2.3
  Top Layer w0.254: U1.15 34.3,12.96 33.38,12.05 33.38,11.94
$1N56627: length 1.9
  Top Layer w0.254: 35.16,13.81 33.62,13.81 R8.1
$1N56629: length 2
  Top Layer w0.254: R9.1 34.13,15.11 34.59,14.66 35.16,14.66
$1N61302: length 21.9
  Top Layer w0.254: v1(36.32,22.22) 36.24,22.31 U1.4 ; v1(27.43,23.75) 26.65,24.53 SW2.1
  Bottom Layer w0.254: v1(36.32,22.22) 34.16,22.22 32.51,20.57 32.51,18.54 30.48,16.51 27.81,16.51 27.43,16.89 v1(27.43,23.75)

## Copper pours and planes (outline as drawn; the poured copper is in the pictures)
+5V on Top Layer: 50.55,17.27 55.15,17.27 55.15,14.68 50.55,14.68
+5V on Top Layer: 52.2,15.37 55.25,15.37 55.25,9.65 52.2,9.65
+5V on Top Layer: 38.99,11.05 40.64,11.05 40.64,9.4 38.99,9.4
+5V on Top Layer: 55.5,19.18 56.85,19.18 56.85,16.38 55.5,16.38
+5V on Top Layer: 54.48,17.27 56.51,17.27 56.51,16.53 54.48,16.53
+5V on Top Layer: 53.72,11.05 55.25,11.05 55.25,9.65 53.72,9.65
+5V on Bottom Layer: 38.86,11.94 55.12,11.94 55.12,8.13 38.86,8.13
+5VUSB on Top Layer: 56.77,10.03 60.45,10.03 60.45,6.48 56.77,6.48
+5VUSB on Top Layer: 43.02,7.19 48.51,7.19 48.51,2.29 43.02,2.29
+5VUSB on Bottom Layer: 43.56,5.46 60.71,5.46 60.71,1.91 43.56,1.91
+5VUSB on Bottom Layer: 57.28,9.78 60.71,9.78 60.71,2.94 57.28,2.94
GND on Top Layer: 66.94,12.2 68.58,12.2 68.58,4.25 66.94,4.25
GND on Top Layer: 57.91,16.51 60.53,16.51 60.53,10.29 57.91,10.29
GND on Top Layer: 40.89,26.67 71.5,26.67 71.5,0 40.89,0
GND on Top Layer: 59.06,15.88 62.61,15.88 62.61,14.86 59.06,14.86
GND on Top Layer: 30.61,26.67 49.54,26.67 49.54,11.33 30.61,11.33
GND on Top Layer: 50.55,21.21 55.18,21.21 55.18,17.53 50.55,17.53
GND on Bottom Layer: 40.39,26.67 71.37,26.67 71.37,0 40.39,0
VCC on Top Layer: 28.07,24.89 35.69,24.89 35.69,21.84 28.07,21.84
VCC on Top Layer: 48.39,10.67 53.09,10.67 53.09,7.37 48.39,7.37
VCC on Bottom Layer: 28.32,25.02 45.97,25.02 45.97,22.99 28.32,22.99
VCC on Bottom Layer: 44.53,10.83 53.06,10.83 53.06,9.55 44.53,9.55
VCC on Bottom Layer: 44.45,25.28 46.1,25.28 46.1,9.65 44.45,9.65
$1N3550 on Top Layer: 61,13.25 62.64,13.25 62.64,6.49 61,6.49
$1N3997 on Top Layer: 60.2,20.95 68.2,20.95 68.2,18.16 60.2,18.16
$1N3997 on Top Layer: 61.25,19.18 62.61,19.18 62.61,16.38 61.25,16.38
$1N3998 on Top Layer: 61.34,14.73 66.42,14.73 66.42,13.76 61.34,13.76
$1N3998 on Top Layer: 65.15,12.83 66.55,12.83 66.55,4.83 65.15,4.83
